# EAGLE schematic schema (EAGLE 6.5.0)
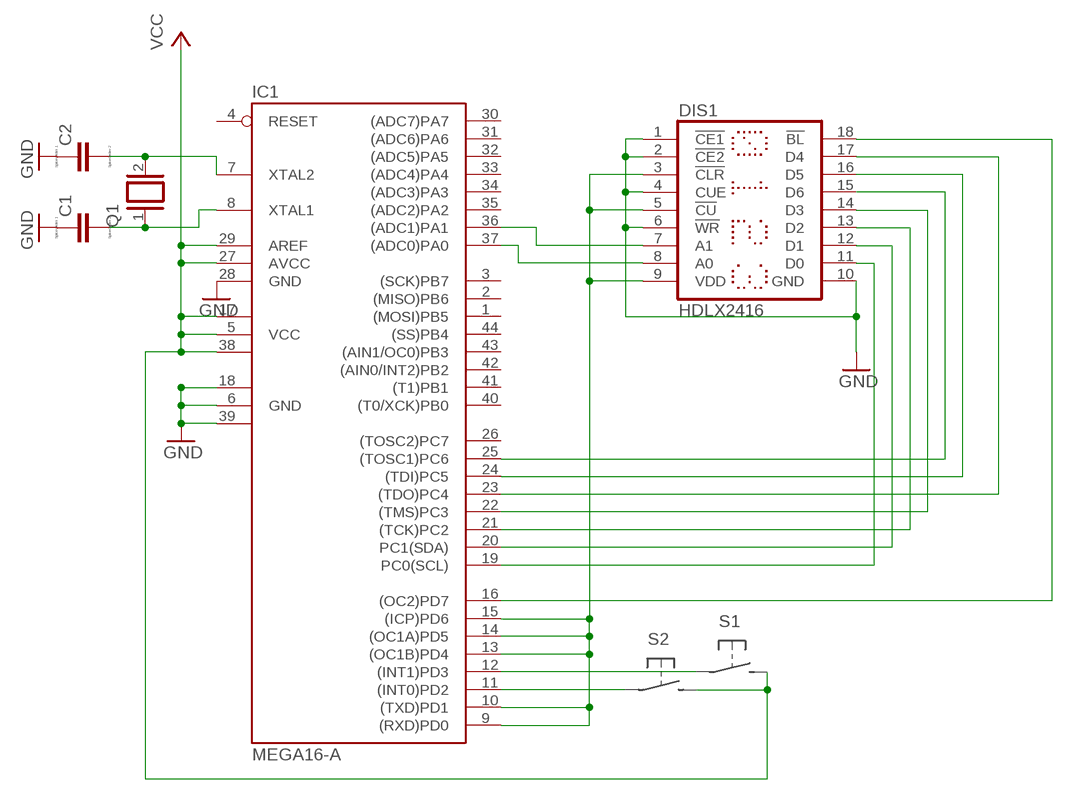
[diagram p0: schematic, sheet 1]

## Parts
C1  CC0504  [C0504]
C2  CC0504  [C0504]
DIS1  HDLX2416  [HDLX2416]
IC1  MEGA16-A  [TQFP44]
Q1  XTAL  [Q]

## Nets
GND: C1.1 C2.1 DIS1.1(!CE1) DIS1.2(!CE2) DIS1.4(CUE) DIS1.6(!WR) DIS1.10(GND) IC1.6(GND) IC1.18(GND1) IC1.28(GND) IC1.39(GND2)
N$1: C1.2 IC1.8(XTAL1) Q1.1
N$2: C2.2 IC1.7(XTAL2) Q1.2
N$3: DIS1.18(!BL) IC1.16((OC2)PD7)
N$4: DIS1.3(!CLR) DIS1.5(!CU) DIS1.9(VDD) IC1.9((RXD)PD0) IC1.10((TXD)PD1) IC1.13((OC1B)PD4) IC1.14((OC1A)PD5) IC1.15((ICP)PD6)
N$5: DIS1.8(A0) IC1.37((ADC0)PA0)
N$6: DIS1.7(A1) IC1.36((ADC1)PA1)
N$7: DIS1.11(D0) IC1.19(PC0(SCL))
N$8: DIS1.12(D1) IC1.20(PC1(SDA))
N$9: DIS1.13(D2) IC1.21((TCK)PC2)
N$10: DIS1.14(D3) IC1.22((TMS)PC3)
N$11: DIS1.15(D6) IC1.25((TOSC1)PC6)
N$12: DIS1.16(D5) IC1.24((TDI)PC5)
N$13: DIS1.17(D4) IC1.23((TDO)PC4)
N$14: IC1.11((INT0)PD2)
N$15: IC1.12((INT1)PD3)
VCC: IC1.5(VCC) IC1.17(VCC1) IC1.27(AVCC) IC1.29(AREF) IC1.38(VCC2)
Unconnected: IC1.1((MOSI)PB5) IC1.2((MISO)PB6) IC1.3((SCK)PB7) IC1.4(RESET) IC1.26((TOSC2)PC7) IC1.30((ADC7)PA7) IC1.31((ADC6)PA6) IC1.32((ADC5)PA5) IC1.33((ADC4)PA4) IC1.34((ADC3)PA3) IC1.35((ADC2)PA2) IC1.40((T0/XCK)PB0) IC1.41((T1)PB1) IC1.42((AIN0/INT2)PB2) IC1.43((AIN1/OC0)PB3) IC1.44((SS)PB4)

## Library data of the parts
C1 C2 = eagle-ltspice:C: CAPACITOR, European symbol; SPICEMODEL: NONE; SPICEPREFIX: C
DIS1 = display-hp:HDLX2416: LED DISPLAY 4-character dot matrix; OC_FARNELL: unknown; OC_NEWARK: unknown
IC1 = atmel:MEGA16: MICROCONTROLLER 16 Kbytes FLASH 1 kbytes SRAM 512 bytes EEPROM USART 8-channel 10 bit ADC Source: avr.lbr; MPN: ATMEGA16-16AU; OC_FARNELL: 9171134; OC_NEWARK: 96K6515
Q1 = special:XTAL: CRYSTAL